# Altium schematic sheet Connector.SchDoc
size A4
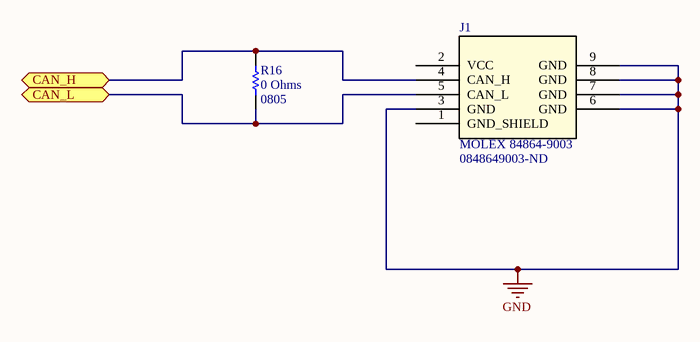
[diagram p0: Connector.SchDoc]

## Parts
J1  MOLEX 84864-9003  Supplier Part Number 1: 0848649003-ND  [MOLEX 84864-9003]
R16  Resistance: 0 Ohms  Package / Case: 0805  [RES0805]  (hidden comment: DNP)

## Ports
CAN_H (bidir), CAN_L (bidir)

## Nets
GND: J1.3(GND) J1.6(GND) J1.7(GND) J1.8(GND) J1.9(GND)
CAN_H: J1.4(CAN_H) R16.2 ; port CAN_H
CAN_L: J1.5(CAN_L) R16.1 ; port CAN_L

Not connected (* = marked no-connect by the designer): J1 1(GND_SHIELD) 2(VCC)

## Library data of the parts
J1 = MOLEX 84864-9003: CAN Micro-Change M12, Right Angle, Male; Detailed Description: 5 Position Circular Connector Receptacle, Male Pins Solder Gold; Ingress Protection: IP67 - Dust Tight, Waterproof; Voltage - Rated: 250VAC, 250VDC; Current Rating: 4A; Fastening Type: Threaded; Orientation: Keyed; Shell Material, Finish: Brass, Nickel Plated; Contact Finish: Gold; Operating Temperature: -20°C ~ 80°C; Supplier 1: Digi-Key
R16 = DNP: RES SMD 0.0 OHM JUMPER 1/8W 0805; Power (Watts): 0.125W, 1/8W; Supplier 1: Digi-Key; Supplier Part Number 2: 311-0.0ARCT-ND; Tolerance: Jumper